# EAGLE design CMRI-Bus-Interface (EAGLE 7.7.0)
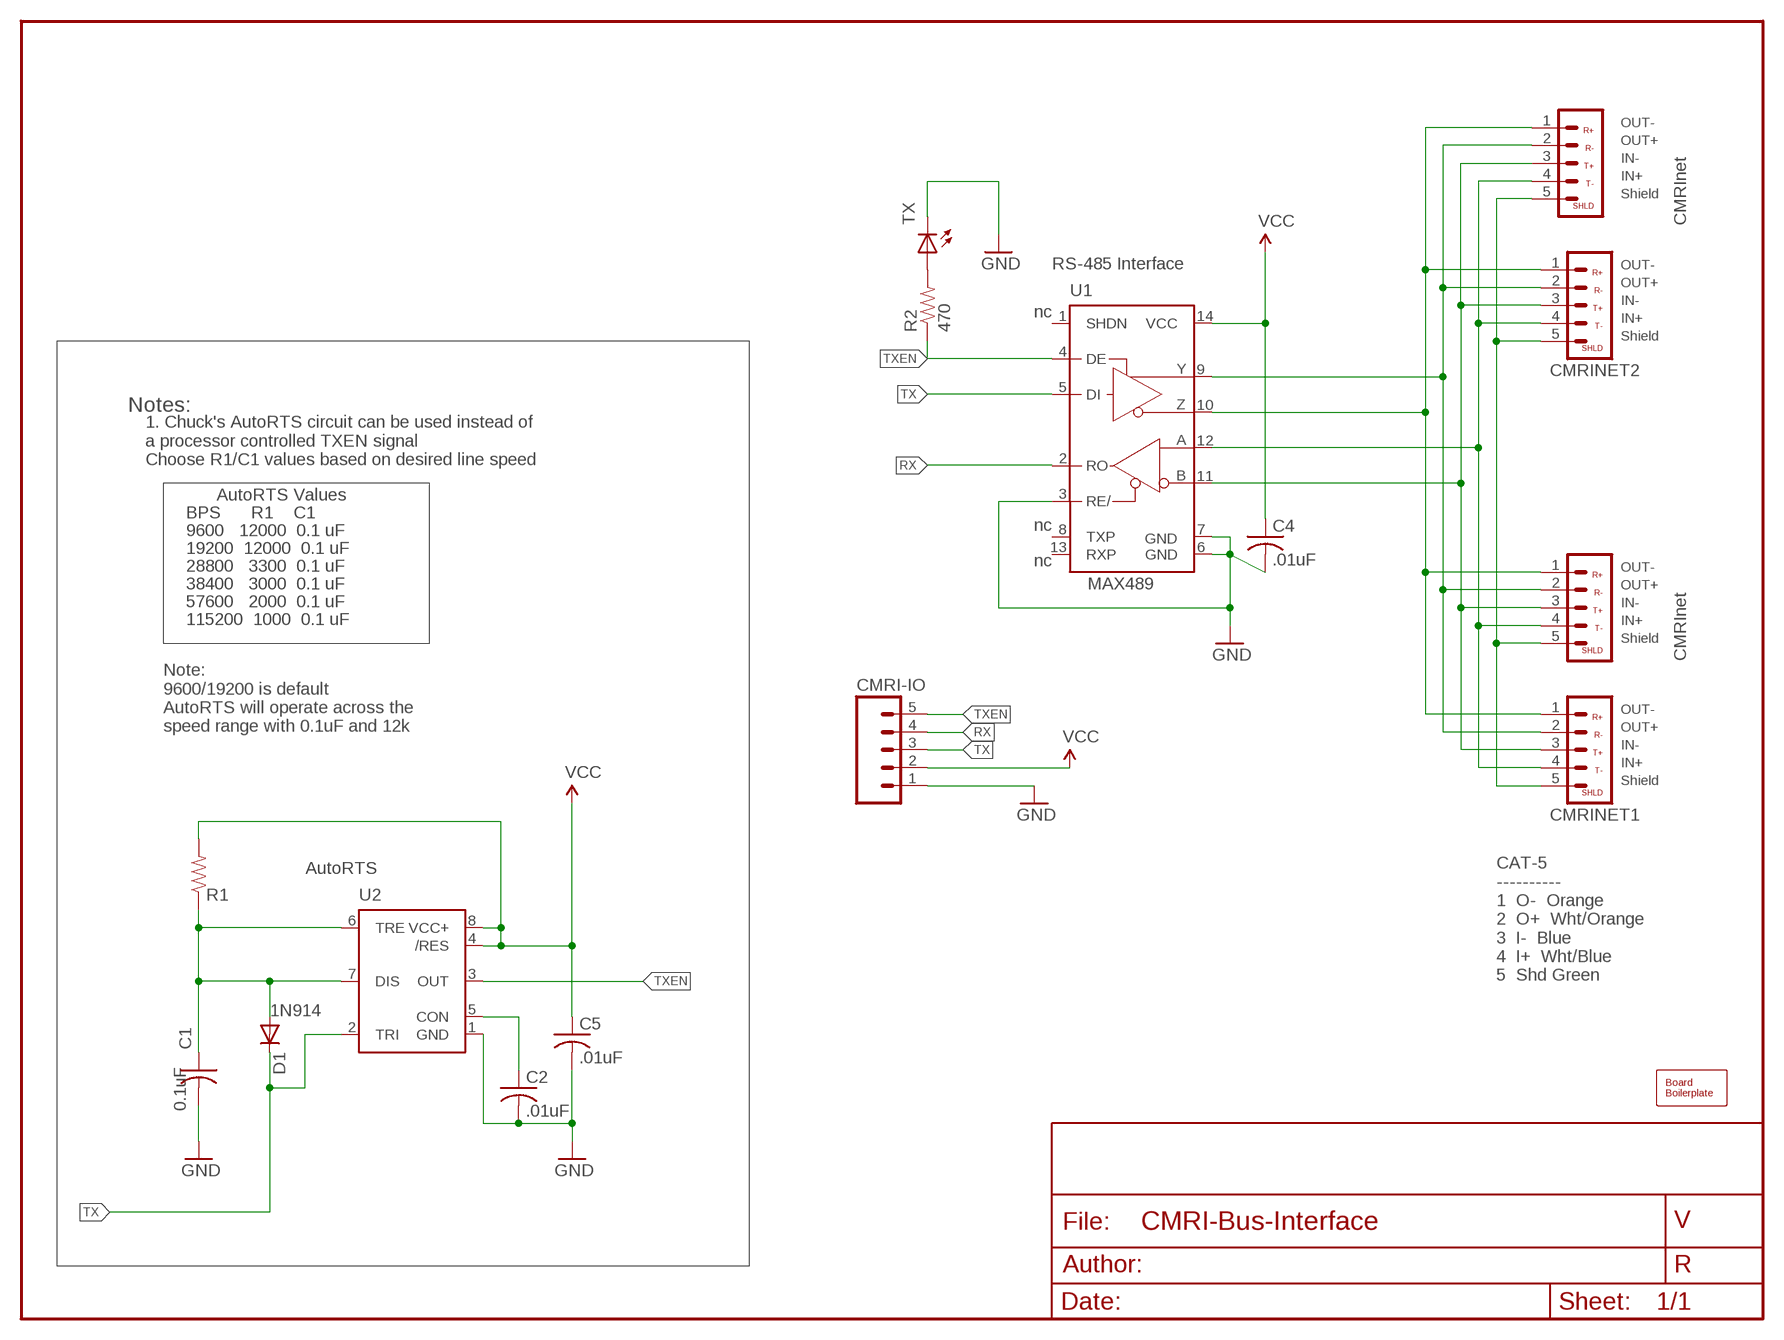
[diagram p0: schematic, sheet 1]

## Parts
BOARD1  BOARD69X70  [BOARD-DINRAIL-2.7IN-7CM]
C1  0.1uF  CAPPTH1  [C050-024X044]
C2  .01uF  CAPPTH1  [C050-024X044]
C4  .01uF  CAPPTH2  [C-PTH-0.100]
C5  .01uF  CAPPTH2  [C-PTH-0.100]
CMRI-IO  CONNECTOR-M05CMRI  [CON-CMRI-IO]
CMRINET1  CMRInet  CONNECTOR-CMRINET3.5MM  [CMRINET-3.5MM]
CMRINET2  CMRInet  CONNECTOR-CMRINET3.5MM  [CMRINET-3.5MM]
CMRINET3  CMRInet  CONNECTOR-CMRINET.156  [KK-156-5]
CMRINET4  CMRInet  CONNECTOR-CMRINET.156  [KK-156-5]
D1  1N4148  DIODE1N4148  [DIODE-1N4148]
R1  RPTH03  [AXIAL-0.3-RES]
R2  470  RPTH03  [AXIAL-0.3-RES]
TX  LEDLED5MM  [LED5MM]
U1  MAX3465CPD  [DIL14]
U2  NE555P  [DIL-08]

## Nets
GND: C1.2 C2.2 C4.2 C5.2 CMRI-IO.1 TX.K(C) U1.3(RE/) U1.6(GND) U1.7(GND) U2.1(GND)
IN+: CMRINET1.4 CMRINET2.4 CMRINET3.4 CMRINET4.4 U1.12(A)
IN-: CMRINET1.3 CMRINET2.3 CMRINET3.3 CMRINET4.3 U1.11(B)
N$29: R2.P$2 TX.A
N$38: C2.1 U2.5(CON)
N$52: C1.1 D1.A R1.P$1 U2.6(TRE) U2.7(DIS)
OUT+: CMRINET1.2 CMRINET2.2 CMRINET3.2 CMRINET4.2 U1.9(Y)
OUT-: CMRINET1.1 CMRINET2.1 CMRINET3.1 CMRINET4.1 U1.10(Z)
RX: CMRI-IO.4 U1.2(RO)
SHIELD: CMRINET1.5 CMRINET2.5 CMRINET3.5 CMRINET4.5
TX: CMRI-IO.3 D1.C U1.5(DI) U2.2(TRI)
TXEN: CMRI-IO.5 R2.P$1 U1.4(DE) U2.3(OUT)
VCC: C4.1 C5.1 CMRI-IO.2 R1.P$2 U1.14(VCC) U2.4(/RES) U2.8(VCC+)
Unconnected: U1.1(SHDN) U1.8(TXP) U1.13(RXP)

## Notes on the sheet
- OUT-
- OUT+
- IN-
- IN+
- Shield
- RS-485 Interface | OUT-
- OUT+
- nc | IN-
- IN+
- Shield
- Notes:
- 1. Chuck's AutoRTS circuit can be used instead of 
  a processor controlled TXEN signal
  Choose R1/C1 values based on desired line speed
- AutoRTS Values
- BPS      R1    C1 | nc
- 9600   12000  0.1 uF
- 19200  12000  0.1 uF | nc
- 28800   3300  0.1 uF | OUT-
- 38400   3000  0.1 uF | MAX489 | OUT+
- 57600   2000  0.1 uF | IN-
- 115200  1000  0.1 uF | IN+
- Shield
- OUT-
- Note: 
  9600/19200 is default
  AutoRTS will operate across the
  speed range with 0.1uF and 12k
- OUT+
- IN-
- IN+
- Shield
- AutoRTS
- CAT-5
  ----------
  1  O-  Orange
  2  O+  Wht/Orange
  3  I-  Blue
  4  I+  Wht/Blue
  5  Shd Green
- 1N914

## Library data of the parts
BOARD1 = SPCoast:BOARD
C1 C2 C4 C5 = SPCoast:CAP*
CMRI-IO = SPCoast:CONNECTOR-M05: Header 5 Standard 5-pin 0.1" header. Use with straight break away headers (SKU : PRT-00116), right angle break away headers (PRT-00553), swiss pins (PRT-00743), machine pins (PRT-00117), and female headers (PRT-00115). Molex polarized connector foot print use with SKU : PRT-08230 with associated crimp pins and housings.
CMRINET1-CMRINET4 = SPCoast:CONNECTOR-CMRINET: CMRINet Top 3.5mm Screw Terminal 5 pos
D1 = SPCoast:DIODE: Diode These are standard reverse protection diodes and small signal diodes. SMA package can handle up to about 1A. SOD-323 can handle about 200mA. What the SOD-323 package when ordering, there are some mfgs out there that are 5-pin packages.
R1 R2 = SPCoast:R*: Resistor Basic schematic elements and footprints for 0603, 1206, and PTH 1/10th watt (small) resistors.
TX = SPCoast:LED*
U1 = SPCoast:MAX346*: +5V, Fail-Safe, 40Mbps, Profibus RS-485/RS-422 Transceivers Source: MAX3465-MAX3469.pdf; MPN: MAX3465CPD+; OC_FARNELL: unknown; OC_NEWARK: 42M5444
U2 = SPCoast:NE555: General purpose bipolar Timer; MF: Arrow Electronics; MPN: NE555N; OC_FARNELL: 1467742; OC_NEWARK: 89K1486

## Board
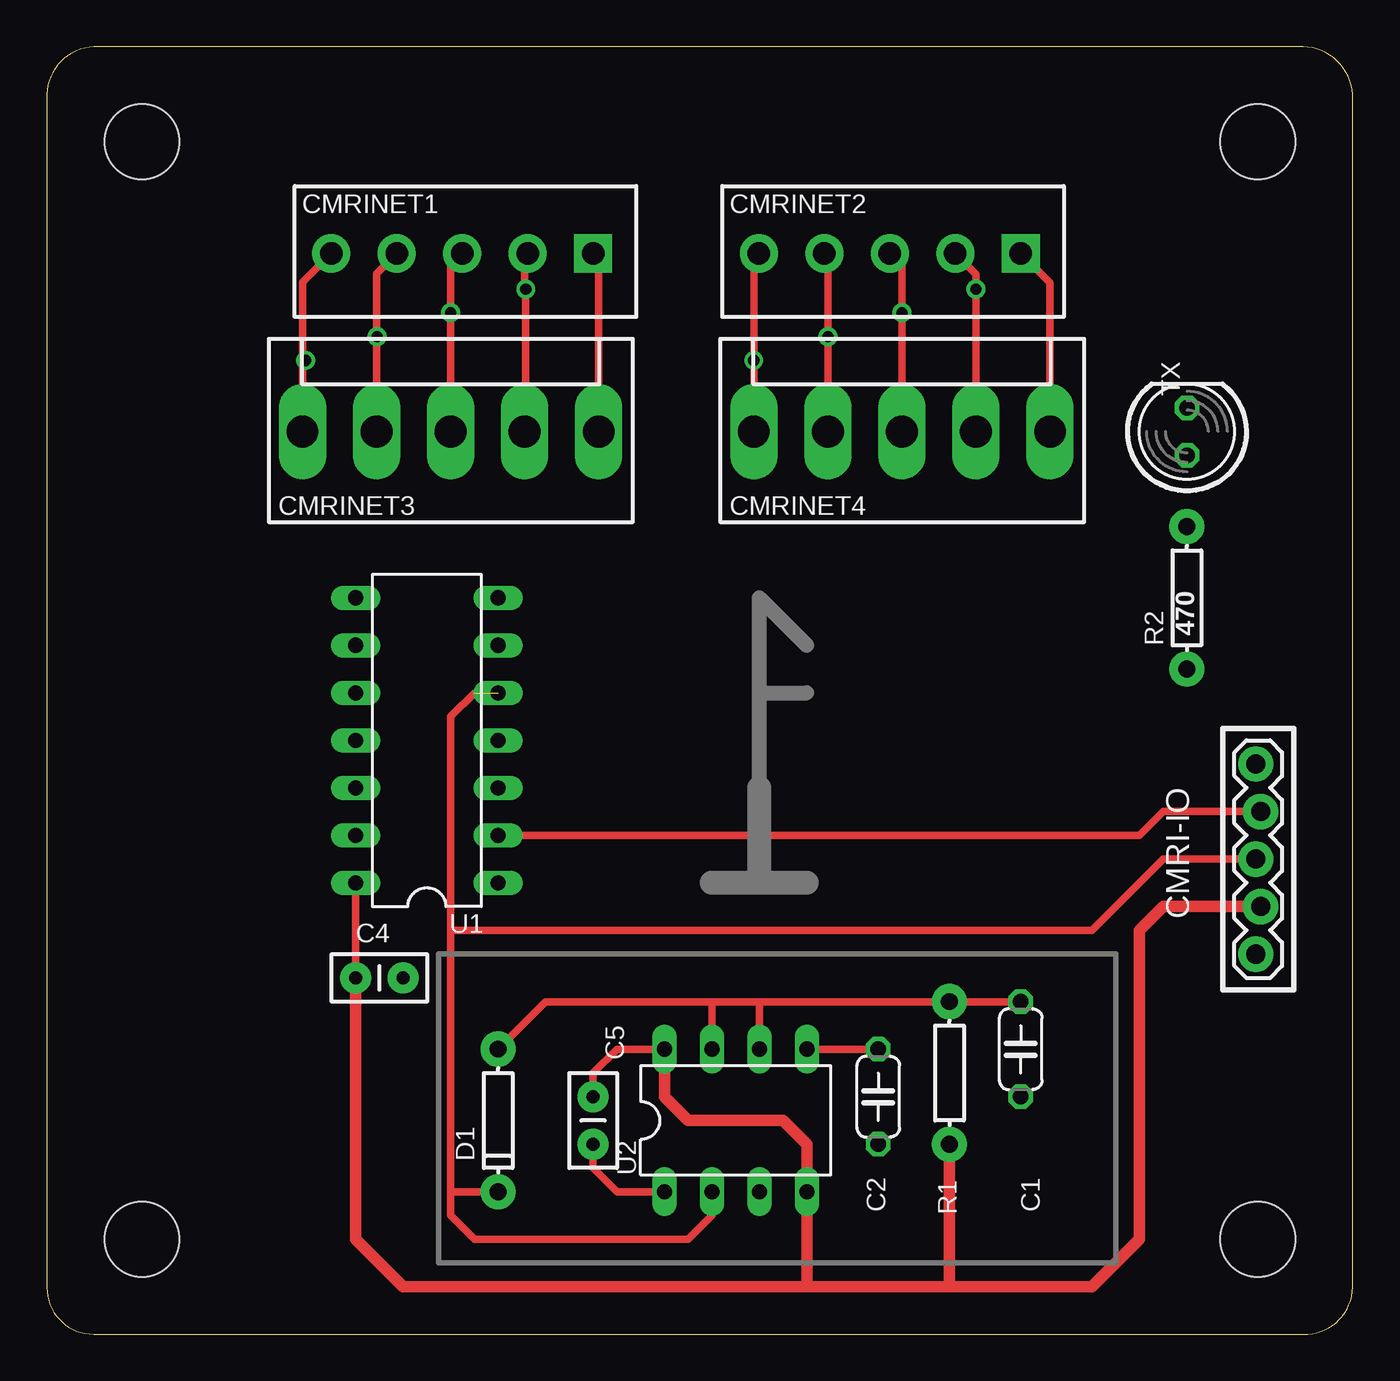
[diagram p1: board, top side]
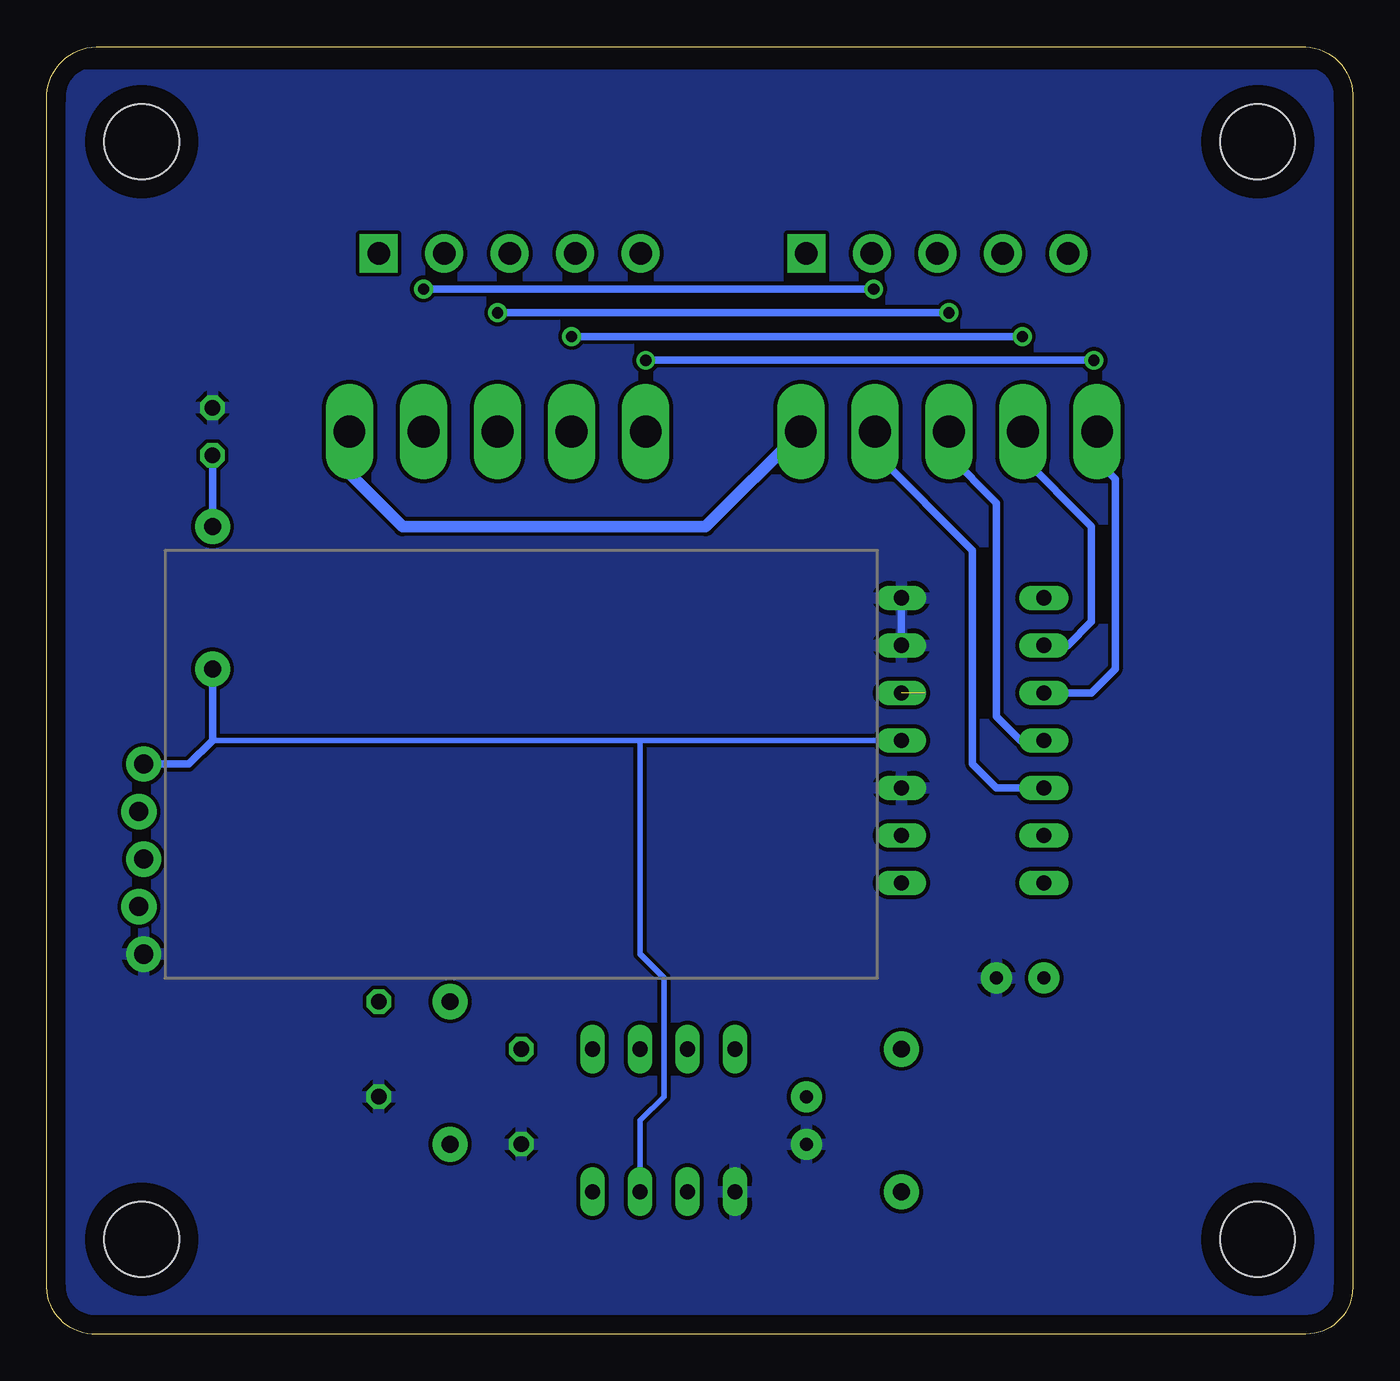
[diagram p2: board, bottom side, seen from below]

Size 69.82 x 68.83 mm. Coordinates in mm from the lower left corner, seen from the top.
Copper layers (1*16): Top 0.035mm / dielectric 1.5mm / Bottom 0.035mm
Design rules "default": minimum track width 10mil, minimum drill 0.6mm, track to track 8mil, track to pad 8mil, pad to pad 8mil, via to via 8mil, smd to smd 8mil, copper to edge 40mil, drill to drill 8mil, minimum pad ring 10mil, minimum via ring 8mil, stop-mask expansion 4mil, vias tented up to drill 0mil, thermal gap 10mil

### Footprints (pad centres in the part's own frame; a part is rotated, then mirrored left to right if it is on the bottom)
BOARD-DINRAIL-2.7IN-7CM = hole 4: 64.742,5.08; 5.08,63.754; 64.742,63.754; 5.08,5.08
C050-024X044 = drill 0.813 octagon: 1 -2.54,0; 2 2.54,0
C-PTH-0.100 = drill 0.7 pad 1.651: 1 -1.27,0; 2 1.27,0
CON-CMRI-IO = drill 1.016 pad 1.88: 1 0,0.127; 2 2.54,-0.127; 3 5.08,0.127; 4 7.62,-0.127; 5 10.16,0.127
CMRINET-3.5MM = drill 1.2 pad 2.032: 1 -6.38,0; 2 -2.88,0; 3 0.62,0; 4 4.12,0 | drill 1.2 pad 2.032 square: 5 7.62,0
KK-156-5 = drill 1.7 pad 2.184 long: 1 -7.92,0; 2 -3.96,0; 3 0,0; 4 3.96,0; 5 7.92,0
DIODE-1N4148 = drill 0.9 pad 1.88: A 3.81,0; C -3.81,0
AXIAL-0.3-RES = drill 0.9 pad 1.88: P$1 -3.81,0; P$2 3.81,0
LED5MM = drill 0.813 octagon: A -1.27,0; K 1.27,0
DIL14 = drill 0.813 long: 1 -7.62,-3.81; 2 -5.08,-3.81; 3 -2.54,-3.81; 4 0,-3.81; 5 2.54,-3.81; 6 5.08,-3.81; 7 7.62,-3.81; 8 7.62,3.81; 9 5.08,3.81; 10 2.54,3.81; 11 0,3.81; 12 -2.54,3.81; 13 -5.08,3.81; 14 -7.62,3.81
DIL-08 = drill 0.813 long: 1 -3.81,-3.81; 2 -1.27,-3.81; 3 1.27,-3.81; 4 3.81,-3.81; 5 3.81,3.81; 6 1.27,3.81; 7 -1.27,3.81; 8 -3.81,3.81

### Placement (x,y rotation side)
BOARD1  0,0 0 top
C1  52.07,15.24 270 top
C2  44.45,12.7 270 top
C4  17.78,19.05 0 top
C5  29.21,11.43 270 top
CMRI-IO  64.77,20.32 90 top
CMRINET1  21.59,57.78 0 top
CMRINET2  44.45,57.78 0 top
CMRINET3  21.59,48.26 0 top
CMRINET4  45.72,48.26 0 top
D1  24.13,11.43 90 top
R1  48.26,13.97 270 top
R2  60.96,39.37 90 top
TX  60.96,48.26 90 top
U1  20.32,31.75 90 top
U2  36.83,11.43 0 top
U$3  [MRCS-LOGO]  38.1,24.13 0 top

### Tracks (layer width: path | path; a pad name or v marks a point on that pad's centre or on a via)
GND
  Top 0.406: C5.2 29.21,8.89 30.48,7.62 U2.1
  Bottom 0.406: U1.7 U1.6
  pour Bottom: 0,67.31 70.49,67.31 70.49,0 0,0
IN+  (via drill 0.6)
  Top 0.406: CMRINET2.4 49.68,56.67 v49.68,55.88 CMRINET4.4 | CMRINET1.4 25.55,57.62 25.55,55.94 v25.61,55.88 25.61,48.32 CMRINET3.4
  Bottom 0.406: v25.61,55.88 v49.68,55.88 | U1.12 19.05,29.21 20.32,30.48 20.32,41.91 25.4,46.99 25.4,48.11 CMRINET3.4
IN-  (via drill 0.6)
  Top 0.406: CMRINET3.3 v21.59,54.61 21.59,57.16 CMRINET1.3 | CMRINET2.3 45.72,57.13 v45.72,54.61 CMRINET4.3
  Bottom 0.406: v21.59,54.61 v45.72,54.61 | U1.11 17.78,31.75 19.05,33.02 19.05,44.45 21.59,46.99 CMRINET3.3
N$29
  Bottom 0.406: TX.A R2.P$2
N$38
  Top 0.406: U2.5 C2.1
N$52
  Top 0.406: D1.A 26.67,17.78 35.56,17.78 | 35.56,17.78 38.1,17.78 | 38.1,17.78 U2.6 | U2.7 35.56,17.78 | 38.1,17.78 R1.P$1 C1.1
OUT+  (via drill 0.6)
  Top 0.406: 17.63,53.37 17.63,56.7 CMRINET1.2 | 17.63,53.37 CMRINET3.2 | CMRINET2.2 41.76,57.59 v41.76,53.34 CMRINET4.2 | 17.63,53.37 v17.66,53.34
  Bottom 0.406: v17.66,53.34 v41.76,53.34 | U1.9 15.24,36.83 13.97,38.1 13.97,43.18 17.78,46.99 17.78,48.11 CMRINET3.2
OUT-  (via drill 0.6)
  Top 0.406: 13.67,51.9 13.67,56.24 CMRINET1.1 | 13.67,51.9 CMRINET3.1 | CMRINET2.1 37.8,57.52 v37.8,52.07 CMRINET4.1 | 13.67,51.9 v13.84,52.07
  Bottom 0.406: v13.84,52.07 v37.8,52.07 | CMRINET3.1 13.67,46.69 12.7,45.72 12.7,35.56 13.97,34.29 U1.10
RX
  Top 0.406: U1.2 58.42,26.67 59.69,27.94 CMRI-IO.4
SHIELD
  Top 0.406: CMRINET3.5 29.51,57.48 CMRINET1.5 | CMRINET2.5 53.64,56.22 CMRINET4.5
  Bottom 0.61: CMRINET3.5 34.59,43.18 50.8,43.18 53.64,46.02 CMRINET4.5
TX  (1 unrouted)
  Top 0.406: U2.2 35.56,6.35 34.29,5.08 22.86,5.08 21.59,6.35 21.59,7.62 | 22.86,34.29 21.59,33.02 21.59,21.59 | 21.59,21.59 21.59,7.62 | 21.59,7.62 D1.C | 21.59,21.59 55.88,21.59 59.69,25.4 CMRI-IO.3
TXEN
  Bottom 0.305: U1.4 38.1,31.75 | 38.1,31.75 60.96,31.75 | U2.3 38.1,11.43 36.83,12.7 36.83,19.05 38.1,20.32 38.1,31.75
  Bottom 0.406: CMRI-IO.5 62.23,30.48 60.96,31.75 R2.P$1
VCC
  Top 0.406: U1.14 C4.1 | C5.1 29.21,13.97 30.48,15.24 U2.8
  Top 0.61: C4.1 16.51,5.08 19.05,2.54 40.64,2.54 | 40.64,2.54 48.26,2.54 | 48.26,2.54 55.88,2.54 58.42,5.08 58.42,21.59 59.69,22.86 CMRI-IO.2 | 40.64,2.54 U2.4 40.64,10.16 39.37,11.43 34.29,11.43 33.02,12.7 U2.8 | R1.P$2 48.26,2.54

### Text on the board
Document: v2.1 Change: TXEN was shorted to RX in v2.0
tDocu: 2020-01 | v2.1p | MRCS Design | CMRI Interface | AutoRTS - Optional
bDocu: AutoRTS Values | BPS R1 C1 | 9600 12000 0.1 uF | 19200 12000 0.1 uF | 28800 3300 0.1 uF | 38400 3000 0.1 uF | 57600 2000 0.1 uF | 115200 1000 0.1 uF